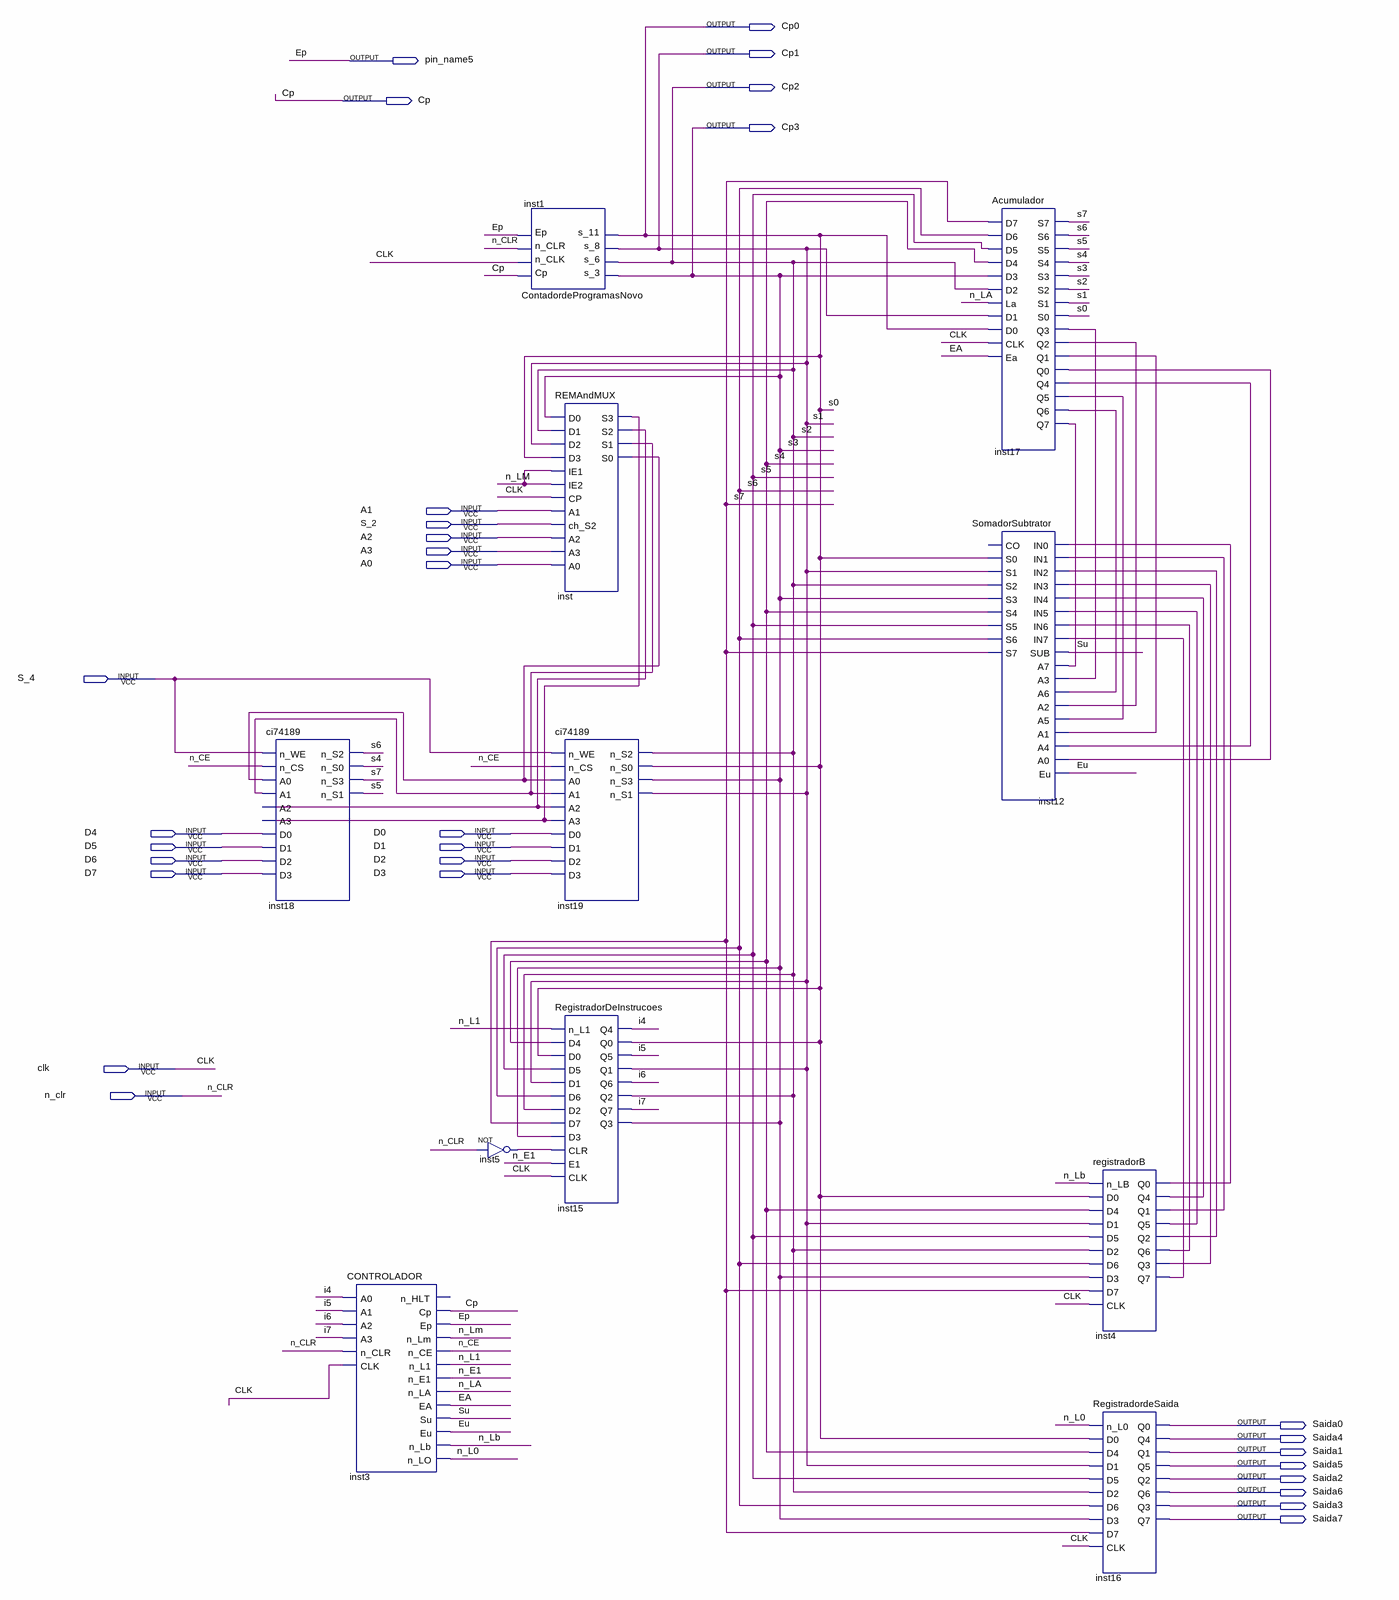
[diagram p0: schematic sheet]
// Quartus schematic sap1_blocks.bdf as structural Verilog: 11 symbols, 30 pins
module sap1_blocks (
  input  A1,
  input  S_2,
  input  A2,
  input  A3,
  input  A0,
  input  S_4,
  input  D4,
  input  D0,
  input  D5,
  input  D1,
  input  D6,
  input  D2,
  input  D7,
  input  D3,
  input  clk,
  input  n_clr,
  output Cp0,
  output Cp1,
  output pin_name5,
  output Cp2,
  output Cp,
  output Cp3,
  output Saida0,
  output Saida4,
  output Saida1,
  output Saida5,
  output Saida2,
  output Saida6,
  output Saida3,
  output Saida7
);

  wire EA, Eu, i4, i5, i6, i7, inst4_q0, inst4_q1, inst4_q2, inst4_q3, inst4_q4, inst4_q5, inst4_q6,
       inst4_q7, inst5_out, inst17_q0, inst17_q1, inst17_q2, inst17_q3, inst17_q4, inst17_q5, inst17_q6,
       inst17_q7, inst_s0, inst_s1, inst_s2, inst_s3, n_CE, n_E1, n_L0, n_L1, n_LA, n_Lb, n_LM, s4, s5, s6,
       s7, Su;

  ci74189 inst18 (
    .n_WE(S_4), .n_CS(n_CE), .A0(inst_s0), .A1(inst_s1), .A2(inst_s2), .A3(inst_s3), .D0(D4), .D1(D5),
    .D2(D6), .D3(D7), .n_S2(s6), .n_S0(s4), .n_S3(s7), .n_S1(s5));
  CONTROLADOR inst3 (
    .A0(i4), .A1(i5), .A2(i6), .A3(i7), .n_CLR(n_clr), .CLK(clk), .Cp(Cp), .Ep(pin_name5), .n_Lm(n_LM),
    .n_CE(n_CE), .n_L1(n_L1), .n_E1(n_E1), .n_LA(n_LA), .EA(EA), .Su(Su), .Eu(Eu), .n_Lb(n_Lb), .n_LO(n_L0));  // open: n_HLT
  ContadordeProgramasNovo inst1 (
    .Cp(Cp), .n_CLK(clk), .n_CLR(n_clr), .Ep(pin_name5), .s_3(Cp3), .s_6(Cp2), .s_8(Cp1), .s_11(Cp0));
  not inst5 (inst5_out, n_clr);
  REMAndMUX inst (
    .D0(Cp3), .D1(Cp2), .D2(Cp1), .D3(Cp0), .IE1(n_LM), .IE2(n_LM), .CP(clk), .A1(A1), .ch_S2(S_2), .A2(A2),
    .A3(A3), .A0(A0), .S3(inst_s3), .S2(inst_s2), .S1(inst_s1), .S0(inst_s0));
  ci74189 inst19 (
    .n_WE(S_4), .n_CS(n_CE), .A0(inst_s0), .A1(inst_s1), .A2(inst_s2), .A3(inst_s3), .D0(D0), .D1(D1),
    .D2(D2), .D3(D3), .n_S2(Cp2), .n_S0(Cp0), .n_S3(Cp3), .n_S1(Cp1));
  RegistradorDeInstrucoes inst15 (
    .n_L1(n_L1), .D4(s4), .D0(Cp0), .D5(s5), .D1(Cp1), .D6(s6), .D2(Cp2), .D7(s7), .D3(Cp3), .CLR(inst5_out),
    .E1(n_E1), .CLK(clk), .Q4(i4), .Q0(Cp0), .Q5(i5), .Q1(Cp1), .Q6(i6), .Q2(Cp2), .Q7(i7), .Q3(Cp3));
  Acumulador inst17 (
    .D7(s7), .D6(s6), .D5(s5), .D4(s4), .D3(Cp3), .D2(Cp2), .La(n_LA), .D1(Cp1), .D0(Cp0), .CLK(clk),
    .Ea(EA), .S7(s7), .S6(s6), .S5(s5), .S4(s4), .S3(Cp3), .S2(Cp2), .S1(Cp1), .S0(Cp0), .Q3(inst17_q3),
    .Q2(inst17_q2), .Q1(inst17_q1), .Q0(inst17_q0), .Q4(inst17_q4), .Q5(inst17_q5), .Q6(inst17_q6),
    .Q7(inst17_q7));
  SomadorSubtrator inst12 (
    .IN0(inst4_q0), .IN1(inst4_q1), .IN2(inst4_q2), .IN3(inst4_q3), .IN4(inst4_q4), .IN5(inst4_q5),
    .IN6(inst4_q6), .IN7(inst4_q7), .SUB(Su), .A7(inst17_q7), .A3(inst17_q3), .A6(inst17_q6), .A2(inst17_q2),
    .A5(inst17_q5), .A1(inst17_q1), .A4(inst17_q4), .A0(inst17_q0), .Eu(Eu), .S0(Cp0), .S1(Cp1), .S2(Cp2),
    .S3(Cp3), .S4(s4), .S5(s5), .S6(s6), .S7(s7));  // open: CO
  registradorB inst4 (
    .n_LB(n_Lb), .D0(Cp0), .D4(s4), .D1(Cp1), .D5(s5), .D2(Cp2), .D6(s6), .D3(Cp3), .D7(s7), .CLK(clk),
    .Q0(inst4_q0), .Q4(inst4_q4), .Q1(inst4_q1), .Q5(inst4_q5), .Q2(inst4_q2), .Q6(inst4_q6), .Q3(inst4_q3),
    .Q7(inst4_q7));
  RegistradordeSaida inst16 (
    .n_L0(n_L0), .D0(Cp0), .D4(s4), .D1(Cp1), .D5(s5), .D2(Cp2), .D6(s6), .D3(Cp3), .D7(s7), .CLK(clk),
    .Q0(Saida0), .Q4(Saida4), .Q1(Saida1), .Q5(Saida5), .Q2(Saida2), .Q6(Saida6), .Q3(Saida3), .Q7(Saida7));

  // Other names for the same wires on the sheet: Ep = pin_name5; s0 = Cp0; s1 = Cp1; s2 = Cp2; s3 = Cp3
endmodule
